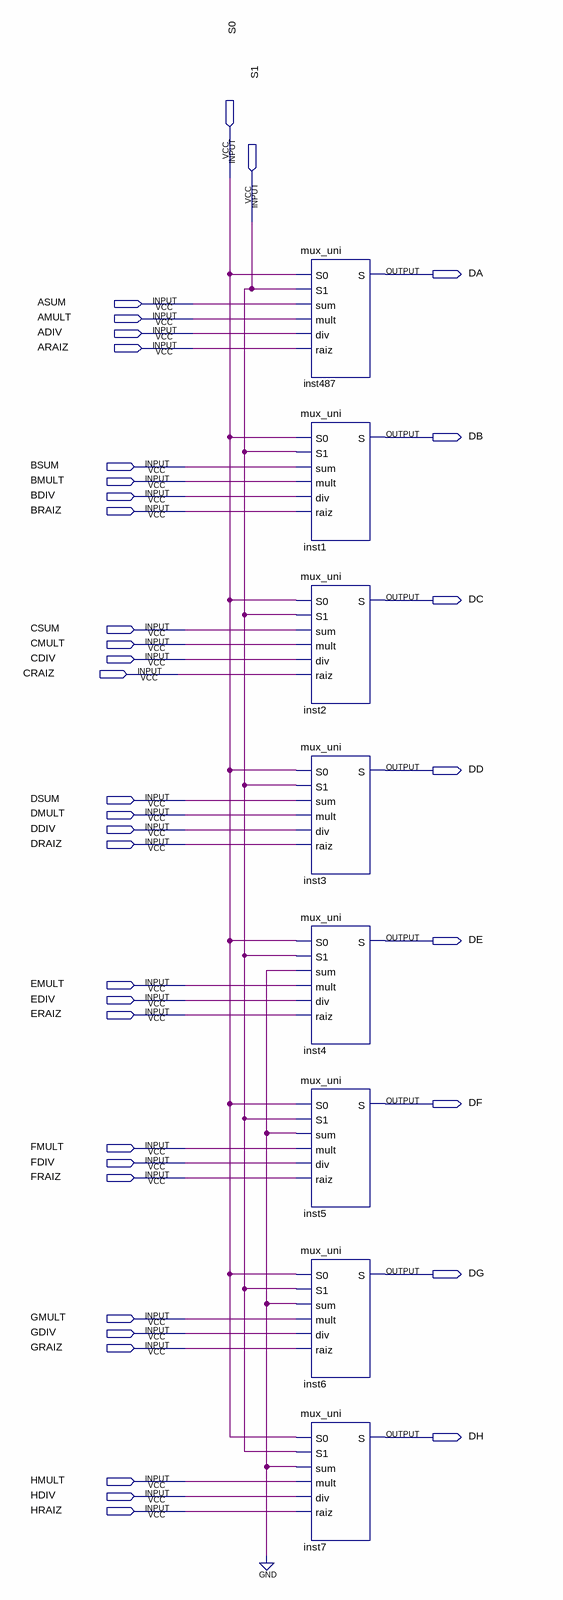
[diagram p0: schematic sheet]
// Quartus schematic mux_level2.bdf as structural Verilog: 8 symbols, 38 pins
module mux_level2 (
  input  S0,
  input  S1,
  input  ASUM,
  input  AMULT,
  input  ADIV,
  input  ARAIZ,
  input  BSUM,
  input  BMULT,
  input  BDIV,
  input  BRAIZ,
  input  CSUM,
  input  CMULT,
  input  CDIV,
  input  CRAIZ,
  input  DSUM,
  input  DMULT,
  input  DDIV,
  input  DRAIZ,
  input  EMULT,
  input  EDIV,
  input  ERAIZ,
  input  FMULT,
  input  FDIV,
  input  FRAIZ,
  input  GMULT,
  input  GDIV,
  input  GRAIZ,
  input  HMULT,
  input  HDIV,
  input  HRAIZ,
  output DA,
  output DB,
  output DC,
  output DD,
  output DE,
  output DF,
  output DG,
  output DH
);

  mux_uni inst487 (.S0(S0), .S1(S1), .sum(ASUM), .mult(AMULT), .div(ADIV), .raiz(ARAIZ), .S(DA));
  mux_uni inst1 (.S0(S0), .S1(S1), .sum(BSUM), .mult(BMULT), .div(BDIV), .raiz(BRAIZ), .S(DB));
  mux_uni inst2 (.S0(S0), .S1(S1), .sum(CSUM), .mult(CMULT), .div(CDIV), .raiz(CRAIZ), .S(DC));
  mux_uni inst3 (.S0(S0), .S1(S1), .sum(DSUM), .mult(DMULT), .div(DDIV), .raiz(DRAIZ), .S(DD));
  mux_uni inst4 (.S0(S0), .S1(S1), .sum(1'b0), .mult(EMULT), .div(EDIV), .raiz(ERAIZ), .S(DE));
  mux_uni inst5 (.S0(S0), .S1(S1), .sum(1'b0), .mult(FMULT), .div(FDIV), .raiz(FRAIZ), .S(DF));
  mux_uni inst6 (.S0(S0), .S1(S1), .sum(1'b0), .mult(GMULT), .div(GDIV), .raiz(GRAIZ), .S(DG));
  mux_uni inst7 (.S0(S0), .S1(S1), .sum(1'b0), .mult(HMULT), .div(HDIV), .raiz(HRAIZ), .S(DH));
endmodule
